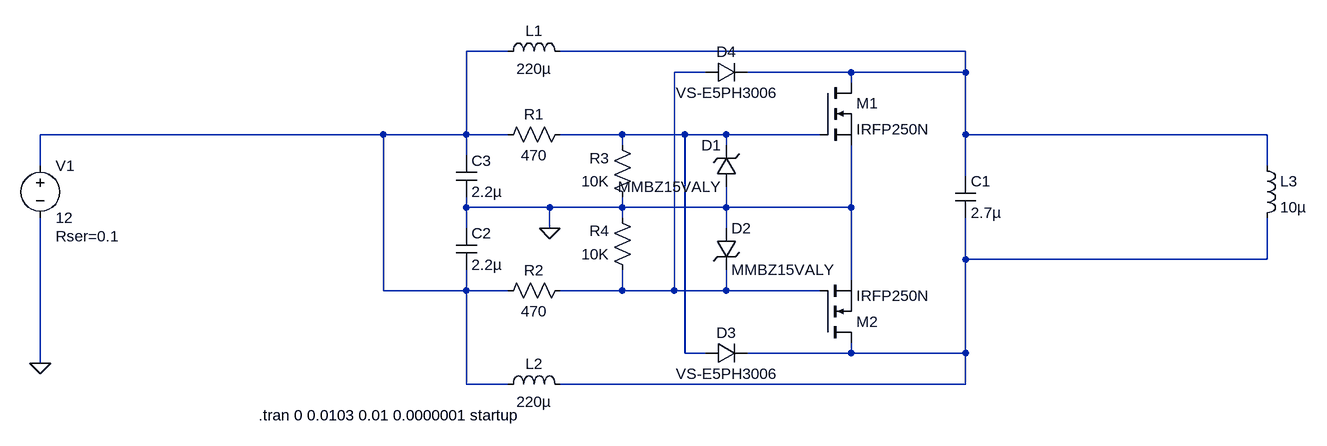
[diagram p0: schematic induction-heater.asc]
induction-heater.asc, the LTspice schematic file:
Version 4
SHEET 1 1524 680
WIRE 240 -48 176 -48
WIRE 944 -48 320 -48
WIRE 544 -16 496 -16
WIRE 768 -16 608 -16
WIRE 944 -16 944 -48
WIRE 944 -16 768 -16
WIRE 768 0 768 -16
WIRE 48 80 -480 80
WIRE 176 80 176 -48
WIRE 176 80 48 80
WIRE 240 80 176 80
WIRE 416 80 320 80
WIRE 512 80 416 80
WIRE 576 80 512 80
WIRE 720 80 576 80
WIRE 944 80 944 -16
WIRE 1408 80 944 80
WIRE 416 96 416 80
WIRE 576 96 576 80
WIRE 176 112 176 80
WIRE -480 128 -480 80
WIRE 1408 128 1408 80
WIRE 944 144 944 80
WIRE 176 192 176 176
WIRE 304 192 176 192
WIRE 416 192 416 176
WIRE 416 192 304 192
WIRE 576 192 576 160
WIRE 576 192 416 192
WIRE 768 192 768 96
WIRE 768 192 576 192
WIRE 416 208 416 192
WIRE 176 224 176 192
WIRE 304 224 304 192
WIRE 576 224 576 192
WIRE 944 272 944 208
WIRE 1408 272 1408 208
WIRE 1408 272 944 272
WIRE 768 304 768 192
WIRE 48 320 48 80
WIRE 176 320 176 288
WIRE 176 320 48 320
WIRE 240 320 176 320
WIRE 416 320 416 288
WIRE 416 320 320 320
WIRE 496 320 496 -16
WIRE 496 320 416 320
WIRE 576 320 576 288
WIRE 576 320 496 320
WIRE 720 320 576 320
WIRE 512 416 512 80
WIRE 544 416 512 416
WIRE 768 416 768 400
WIRE 768 416 608 416
WIRE 944 416 944 272
WIRE 944 416 768 416
WIRE -480 432 -480 208
WIRE 176 464 176 320
WIRE 240 464 176 464
WIRE 944 464 944 416
WIRE 944 464 320 464
FLAG -480 432 0
FLAG 304 224 0
SYMBOL ind 224 -32 R270
WINDOW 0 32 56 VTop 2
WINDOW 3 5 56 VBottom 2
SYMATTR InstName L1
SYMATTR Value 220µ
SYMATTR SpiceLine Rser=0.06
SYMBOL ind 224 480 R270
WINDOW 0 32 56 VTop 2
WINDOW 3 5 56 VBottom 2
SYMATTR InstName L2
SYMATTR Value 220µ
SYMATTR SpiceLine Rser=0.06
SYMBOL res 336 64 R90
WINDOW 0 0 56 VBottom 2
WINDOW 3 32 56 VTop 2
SYMATTR InstName R1
SYMATTR Value 470
SYMBOL res 336 304 R90
WINDOW 0 0 56 VBottom 2
WINDOW 3 32 56 VTop 2
SYMATTR InstName R2
SYMATTR Value 470
SYMBOL res 432 192 R180
WINDOW 0 36 76 Left 2
WINDOW 3 36 40 Left 2
SYMATTR InstName R3
SYMATTR Value 10K
SYMBOL res 432 304 R180
WINDOW 0 36 76 Left 2
WINDOW 3 36 40 Left 2
SYMATTR InstName R4
SYMATTR Value 10K
SYMBOL voltage -480 112 R0
WINDOW 123 0 0 Left 0
WINDOW 39 24 124 Left 2
SYMATTR SpiceLine Rser=0.1
SYMATTR InstName V1
SYMATTR Value 12
SYMBOL zener 592 160 R180
WINDOW 0 24 64 Left 2
WINDOW 3 24 0 Left 2
SYMATTR InstName D1
SYMATTR Value MMBZ15VALY
SYMBOL zener 560 224 R0
SYMATTR InstName D2
SYMATTR Value MMBZ15VALY
SYMBOL diode 544 432 R270
WINDOW 0 32 32 VTop 2
WINDOW 3 0 32 VBottom 2
SYMATTR InstName D3
SYMATTR Value VS-E5PH3006
SYMBOL diode 544 0 R270
WINDOW 0 32 32 VTop 2
WINDOW 3 0 32 VBottom 2
SYMATTR InstName D4
SYMATTR Value VS-E5PH3006
SYMBOL nmos 720 0 R0
SYMATTR InstName M1
SYMATTR Value IRFP250N
SYMBOL nmos 720 400 M180
SYMATTR InstName M2
SYMATTR Value IRFP250N
SYMBOL cap 928 144 R0
SYMATTR InstName C1
SYMATTR Value 2.7µ
SYMATTR SpiceLine Rser=0.2
SYMBOL ind 1392 112 R0
SYMATTR InstName L3
SYMATTR Value 10µ
SYMATTR SpiceLine Rser=0.02
SYMBOL cap 160 224 R0
SYMATTR InstName C2
SYMATTR Value 2.2µ
SYMBOL cap 160 112 R0
SYMATTR InstName C3
SYMATTR Value 2.2µ
TEXT -144 512 Left 2 !.tran 0 0.0103 0.01 0.0000001 startup

The netlist it stands for:
* induction-heater.asc
L1 N001 N002 220µ Rser=0.06
L2 N001 N005 220µ Rser=0.06
R1 N004 N001 470
R2 N003 N001 470
R3 0 N004 10K
R4 N003 0 10K
V1 N001 0 12 Rser=0.1
D1 0 N004 MMBZ15VALY
D2 0 N003 MMBZ15VALY
D3 N004 N005 VS-E5PH3006
D4 N003 N002 VS-E5PH3006
M1 N002 N004 0 0 IRFP250N
M2 N005 N003 0 0 IRFP250N
C1 N002 N005 2.7µ Rser=0.2
L3 N002 N005 10µ Rser=0.02
C2 0 N001 2.2µ
C3 N001 0 2.2µ
.model D D
.lib standard.dio
.model NMOS NMOS
.model PMOS PMOS
.lib standard.mos
.tran 0 0.0103 0.01 0.0000001 startup
.backanno
.end